# Altium schematic sheet sensor.SchDoc
size A4
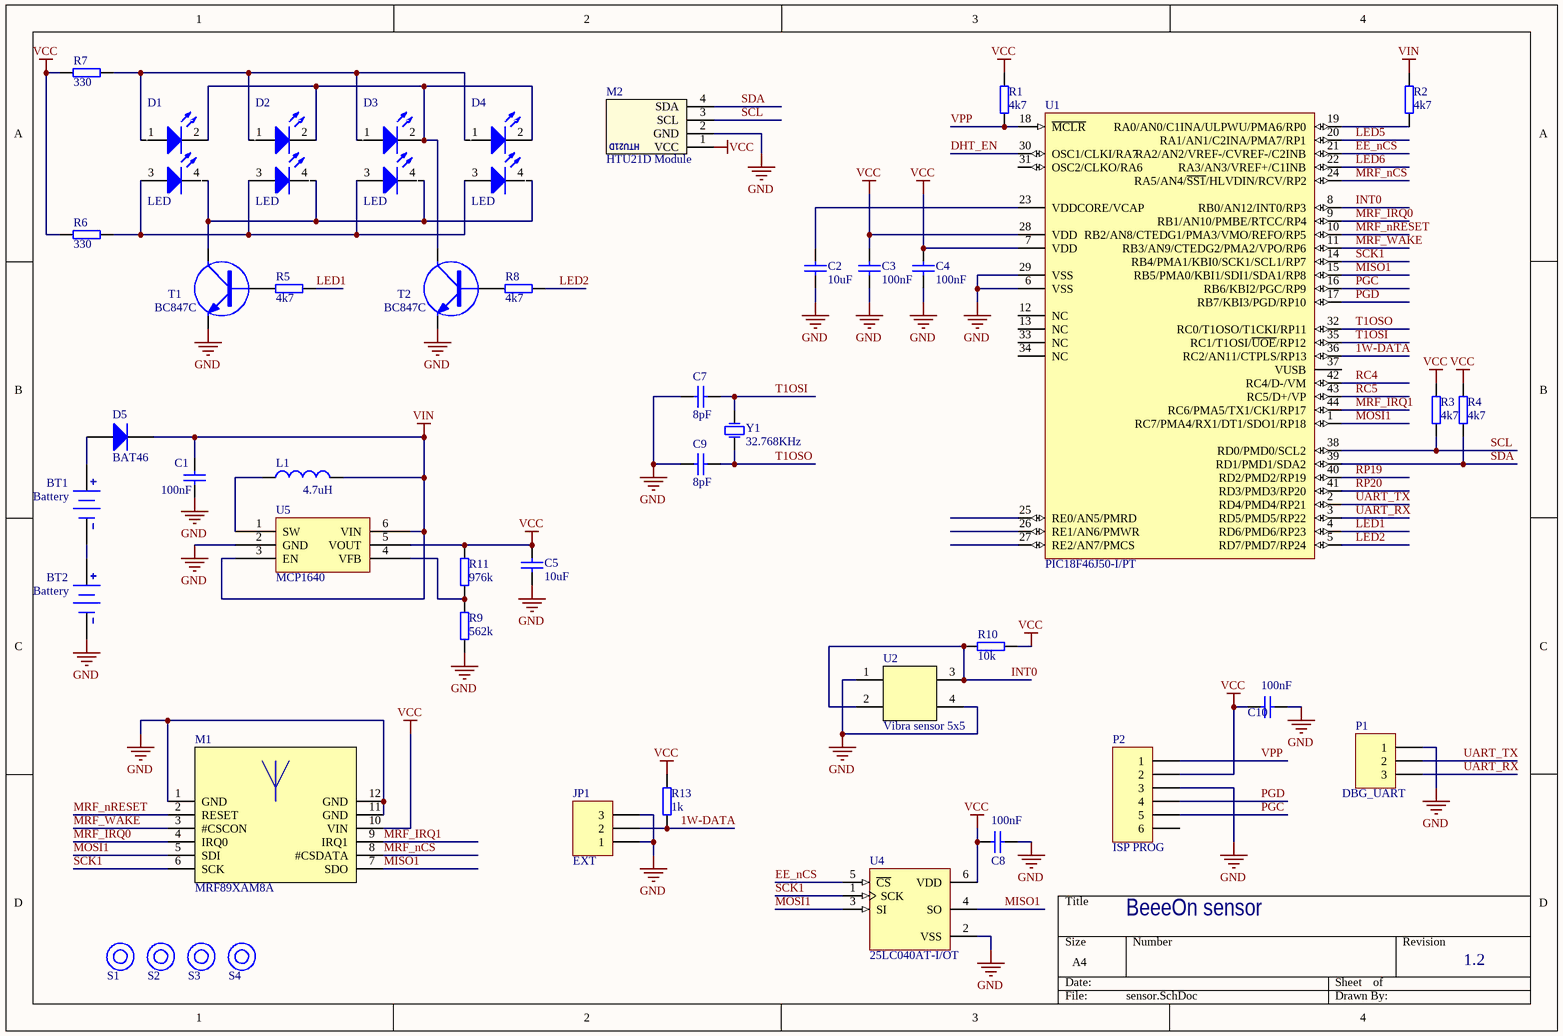
[diagram p0: sensor.SchDoc]

## Parts
BT1  Battery  [BATT_HOLDER-AAA]
BT2  Battery  [BATT_HOLDER-AAA]
C1  100nF  [C0805]
C2  10uF  [C0805]
C3  100nF  [C0805]
C4  100nF  [C0805]
C5  10uF  [C0805]
C7  8pF  [C0805]
C8  100nF  [C0805]
C9  8pF  [C0805]
C10  100nF  [C0805]
D1  LED  [LED MULTI2]
D2  LED  [LED MULTI2]
D3  LED  [LED MULTI2]
D4  LED  [LED MULTI2]
D5  BAT46  [SOD-323]
JP1  EXT  [HDR1X3H]
L1  value 4.7uH  [IND3x3]  (hidden comment: Inductor)
M1  MRF89XAM8A  [MRF89XAM8A]
M2  HTU21D Module  [HTU21D]
P1  DBG_UART  [HDR1X3]
P2  ISP PROG  [HDR1X6]
R1  4k7  [R0805]
R2  4k7  [R0805]
R3  4k7  [R0805]
R4  4k7  [R0805]
R5  4k7  [R0805]
R6  330  [R0805]
R7  330  [R0805]
R8  4k7  [R0805]
R9  562k  [R0805]
R10  10k  [R0805]
R11  976k  [R0805]
R13  1k  [R0805]
S1  TARGET  [TARGET]  (value not drawn)
S2  TARGET  [TARGET]  (value not drawn)
S3  TARGET  [TARGET]  (value not drawn)
S4  TARGET  [TARGET]  (value not drawn)
T1  BC847C  [SOT23]
T2  BC847C  [SOT23]
U1  PIC18F46J50-I/PT  [TQFP-PT44_N]
U2  Vibra sensor 5x5  [VIBRATION_SENSOR 5x5]
U4  25LC040AT-I/OT  [SOT-23-OT6_N]
U5  MCP1640  [SOT-23-OT6_N]
Y1  32.768KHz  [R38]

## Nets
GND: BT2.2(-) C1.1 C2.2 C3.1 C4.2 C5.2 C7.2 C8.1 C9.2 C10.2 JP1.1 JP1.3 M1.1(GND) M1.11(GND) M1.12(GND) M2.2(GND) P1.1 P2.3 R9.2 T1.2(E) T2.2(E) U1.6(VSS) U1.29(VSS) U2.1 U2.4 U4.2(VSS) U5.2(GND)
VCC: C3.2 C4.1 C5.1 C8.2 C10.1 M1.10(VIN) M2.1(VCC) P2.2 R1.2 R3.2 R4.2 R6.1 R7.1 R10.1 R11.1 R13.1 U1.7(VDD) U1.28(VDD) U4.6(VDD) U5.5(VOUT)
VIN: C1.2 D5.2(K) L1.2 R2.1 U5.3(EN) U5.6(VIN)
1W-DATA: JP1.2 R13.2 U1.36(RC2/AN11/CTPLS/RP13)
DHT_EN: U1.30(OSC1/CLKI/RA7)
EE_nCS: U1.21(RA2/AN2/VREF-/CVREF-/C2INB) U4.5(~{CS})
INT0: R10.2 U1.8(RB0/AN12/INT0/RP3) U2.2 U2.3
LED1: R5.1 U1.4(RD6/PMD6/RP23)
LED2: R8.1 U1.5(RD7/PMD7/RP24)
LED5: U1.20(RA1/AN1/C2INA/PMA7/RP1)
LED6: U1.22(RA3/AN3/VREF+/C1INB)
MISO1: M1.7(SDO) U1.15(RB5/PMA0/KBI1/SDI1/SDA1/RP8) U4.4(SO)
MOSI1: M1.5(SDI) U1.1(RC7/PMA4/RX1/DT1/SDO1/RP18) U4.3(SI)
MRF_IRQ0: M1.4(IRQ0) U1.9(RB1/AN10/PMBE/RTCC/RP4)
MRF_IRQ1: M1.9(IRQ1) U1.44(RC6/PMA5/TX1/CK1/RP17)
MRF_nCS: M1.8(#CSDATA) U1.24(RA5/AN4/~{SS1}/HLVDIN/RCV/RP2)
MRF_nRESET: M1.2(RESET) U1.10(RB2/AN8/CTEDG1/PMA3/VMO/REFO/RP5)
MRF_WAKE: M1.3(#CSCON) U1.11(RB3/AN9/CTEDG2/PMA2/VPO/RP6)
PGC: P2.5 U1.16(RB6/KBI2/PGC/RP9)
PGD: P2.4 U1.17(RB7/KBI3/PGD/RP10)
RC4: U1.42(RC4/D-/VM)
RC5: U1.43(RC5/D+/VP)
RP19: U1.40(RD2/PMD2/RP19)
RP20: U1.41(RD3/PMD3/RP20)
SCK1: M1.6(SCK) U1.14(RB4/PMA1/KBI0/SCK1/SCL1/RP7) U4.1(SCK)
SCL: M2.3(SCL) R3.1 U1.38(RD0/PMD0/SCL2)
SDA: M2.4(SDA) R4.1 U1.39(RD1/PMD1/SDA2)
T1OSI: C7.1 U1.35(RC1/T1OSI/~{UOE}/RP12) Y1.2(OSC2)
T1OSO: C9.1 U1.32(RC0/T1OSO/T1CKI/RP11) Y1.1(OSC1)
UART_RX: P1.3 U1.3(RD5/PMD5/RP22)
UART_TX: P1.2 U1.2(RD4/PMD4/RP21)
VPP: P2.1 R1.1 U1.18(~{MCLR})
NetBT1_1: BT1.1(+) D5.1(A)
NetBT1_2: BT1.2(-) BT2.1(+)
NetC2_1: C2.1 U1.23(VDDCORE/VCAP)
NetD1_1: D1.1(A) D2.1(A) D3.1(A) D4.1(A) R7.2
NetD1_2: D1.2(K) D2.2(K) D3.2(K) D4.2(K) T2.3(C)
NetD1_3: D1.3(A) D2.3(A) D3.3(A) D4.3(A) R6.2
NetD1_4: D1.4(K) D2.4(K) D3.4(K) D4.4(K) T1.3(C)
NetL1_1: L1.1 U5.1(SW)
NetR2_2: R2.2 U1.19(RA0/AN0/C1INA/ULPWU/PMA6/RP0)
NetR5_2: R5.2 T1.1(B)
NetR8_2: R8.2 T2.1(B)
NetR9_1: R9.1 R11.2 U5.4(VFB)

Not connected (* = marked no-connect by the designer): P2 6; U1 12(NC) 13(NC) 25(RE0/AN5/PMRD) 26(RE1/AN6/PMWR) 27(RE2/AN7/PMCS) 31(OSC2/CLKO/RA6) 33(NC) 34(NC) 37(VUSB)

## Notes on the sheet
- BeeeOn sensor
- 1.2
- (in symbol HTU21D_MODULE) HTU21D

## Library data of the parts
BT1 BT2 = Battery: Multicell Battery; Published: 24-Mar-1999; LatestRevisionDate: 17-Jul-2002; LatestRevisionNote: Re-released for DXP Platform.; PackageReference: BAT-2; Publisher: Altium Limited
C1-C5 C7-C10 = Cap: Capacitor; Published: 8-Jun-2000; LatestRevisionDate: 17-Jul-2002; LatestRevisionNote: Re-released for DXP Platform.; PackageReference: 0402; Publisher: Altium Limited
  C1 C3 C4 C8 C10: Value: 100nF
  C2 C5: Value: 10uF
  C7 C9: Value: 8pF
D1-D4 = LED MULT 2 S: farnell: 2426205
D5 = Diode: Default Diode; pin to pad: 1>2 2>1; Value: S2D; Published: 8-Jun-2000; LatestRevisionDate: 17-Jul-2002; LatestRevisionNote: Re-released for DXP Platform.; PackageDocument: Sep-1996; PackageReference: SMB; Publisher: Altium Limited; Code_JEDEC: DO-214-AA; Manufacture: *; Farnell: *
JP1 = Header 3H: Header, 3-Pin, Right Angle; LatestRevisionDate: 17-Jul-2002; LatestRevisionNote: Re-released for DXP Platform.; Publisher: Altium Limited
L1 = Inductor: Code_IEC: 1005; Published: 8-Jun-2000; LatestRevisionDate: 17-Jul-2002; LatestRevisionNote: Re-released for DXP Platform.; PackageReference: 0402-A; Publisher: Altium Limited; Code_JEITA: 0402; farnell: 2292502
M1 = MRF89XAM8A: 868 MHz Ultra-Low Power  Sub-GHz Transceiver Module; farnell: 1875307
M2 = HTU21D_MODULE: Digital Barometric Pressure Sensor Module
P1 = Header 3: Header, 3-Pin; LatestRevisionDate: 17-Jul-2002; LatestRevisionNote: Re-released for DXP Platform.; Publisher: Altium Limited
P2 = Header 6: Header, 6-Pin; LatestRevisionDate: 17-Jul-2002; LatestRevisionNote: Re-released for DXP Platform.; Publisher: Altium Limited
R1-R11 R13 = Res2: Resistor; Published: 8-Jun-2000; LatestRevisionDate: 17-Jul-2002; LatestRevisionNote: Re-released for DXP Platform.; PackageReference: 0603; Publisher: Altium Limited
  R1-R5 R8: Value: 4k7
  R6 R7: Value: 330
  R9: Value: 562k
  R10: Value: 10k
  R11: Value: 976k
  R13: Value: 1k
T1 T2 = NPN_BC847C: NPN General-purpose Transistor; Published: 17-Sep-2003; LatestRevisionDate: 12-Dec-2006; LatestRevisionNote: IPC-7351 Footprint Added.; DatasheetVersion: 4-Feb-2002; PackageVersion: May-1999; PackageReference: SOT23; Publisher: Altium Limited; PackageDescription: 3-Pin SOT-23 Package 0.95 mm Pitch, 2.3 mm Lead Span; ComponentLink1Description: Manufacturer Link; ComponentLink1URL: http://www.nxp.com; ComponentLink2Description: Datasheet; ComponentLink2URL: http://www.nxp.com/acrobat_download/datasheets/BC847_BC547_SER_6.pdf
U1 = PIC18F46J50-I/PT: Low Power, High Performance USB Microcontroller with nanoWatt XLP Technology, 44-pin TQFP, Industrial Temperature; FirstPublished: 2-Dec-2009; DatasheetVersion: revC, Oct-2009; PackageVersion: revBB, Aug-2009; PackageReference: TQFP-PT44; Publisher: Altium Limited; PackageDescription: 44-Lead Plastic Thin Quad Flatpack (PT) - 10x10x1mm Body, 2.00mm [TQFP]; Supplier 1: Digi-Key; Supplier Part Number 1: PIC18F46J50-I/PT-ND; Supplier 2: Farnell; Supplier Part Number 2: 1706312; Supplier 3: Newark; Supplier Part Number 3: 98M1834; Code_JEDEC: MS-026; ComponentLink1Description: Datasheet; ComponentLink1URL: http://ww1.microchip.com/downloads/en/DeviceDoc/39931c.pdf; ComponentLink2Description: Packaging Specification; ComponentLink2URL: http://www.microchip.com/stellent/groups/techpub_sg/documents/packagingspec/en012702.pdf; ComponentLink3Description: Microchip.com Home; ComponentLink3URL: http://www.microchip.com/; farnell: 1706312
U2 = Vibra sensor: Vibration sensor 5x5; ebay: *
U4 = 25LC040AT-I/OT: 4K SPI Bus Serial EEPROM, 6-Pin SOT-23, Industrial Temperature, Tape and Reel; FirstPublished: 29-Jan-2009; LatestRevisionDate: 02-Dec-2009; LatestRevisionNote: Updated to datasheet revision F, Jul-2009; DatasheetVersion: revF, Jul-2009; PackageVersion: revBB, Aug-2009; PackageReference: SOT-23-OT6; Publisher: Altium Limited; PackageDescription: 6-Lead Plastic Small Outline Transistor (OT) [SOT-23]; Supplier 1: Digi-Key; Supplier Part Number 1: 25LC040AT-I/OTTR-ND; Supplier 2: Digi-Key; Supplier Part Number 2: 25LC040AT-I/OTCT-ND; Supplier 3: Digi-Key; Supplier Part Number 3: 25LC040AT-I/OTDKR-ND; Supplier 4: Farnell; Supplier Part Number 4: 1331388; Supplier 5: Newark; Supplier Part Number 5: 72J3691; Code_IPC: SOT26A-6; ComponentLink1Description: Datasheet; ComponentLink1URL: http://ww1.microchip.com/downloads/en/DeviceDoc/21827F.pdf; ComponentLink2Description: Packaging Specification; ComponentLink2URL: http://www.microchip.com/stellent/groups/techpub_sg/documents/packagingspec/en012702.pdf; ComponentLink3Description: Microchip.com Home; ComponentLink3URL: http://www.microchip.com/; farnell: 1331388
U5 = MCP1640: 0.65V Start-up Synchronous Boost Regulator; farnell: 1800208
Y1 = XTAL: Crystal Oscillator; Value: 25MHz; Published: 8-Jun-2000; LatestRevisionDate: 17-Jul-2002; LatestRevisionNote: Re-released for DXP Platform.; PackageReference: R38; Publisher: Altium Limited